# Altium schematic sheet PT-PWR-EPS-002_v1 Project.SchDoc
size A4; DocumentNumber: 12; SheetNumber: 12; SheetTotal: 12
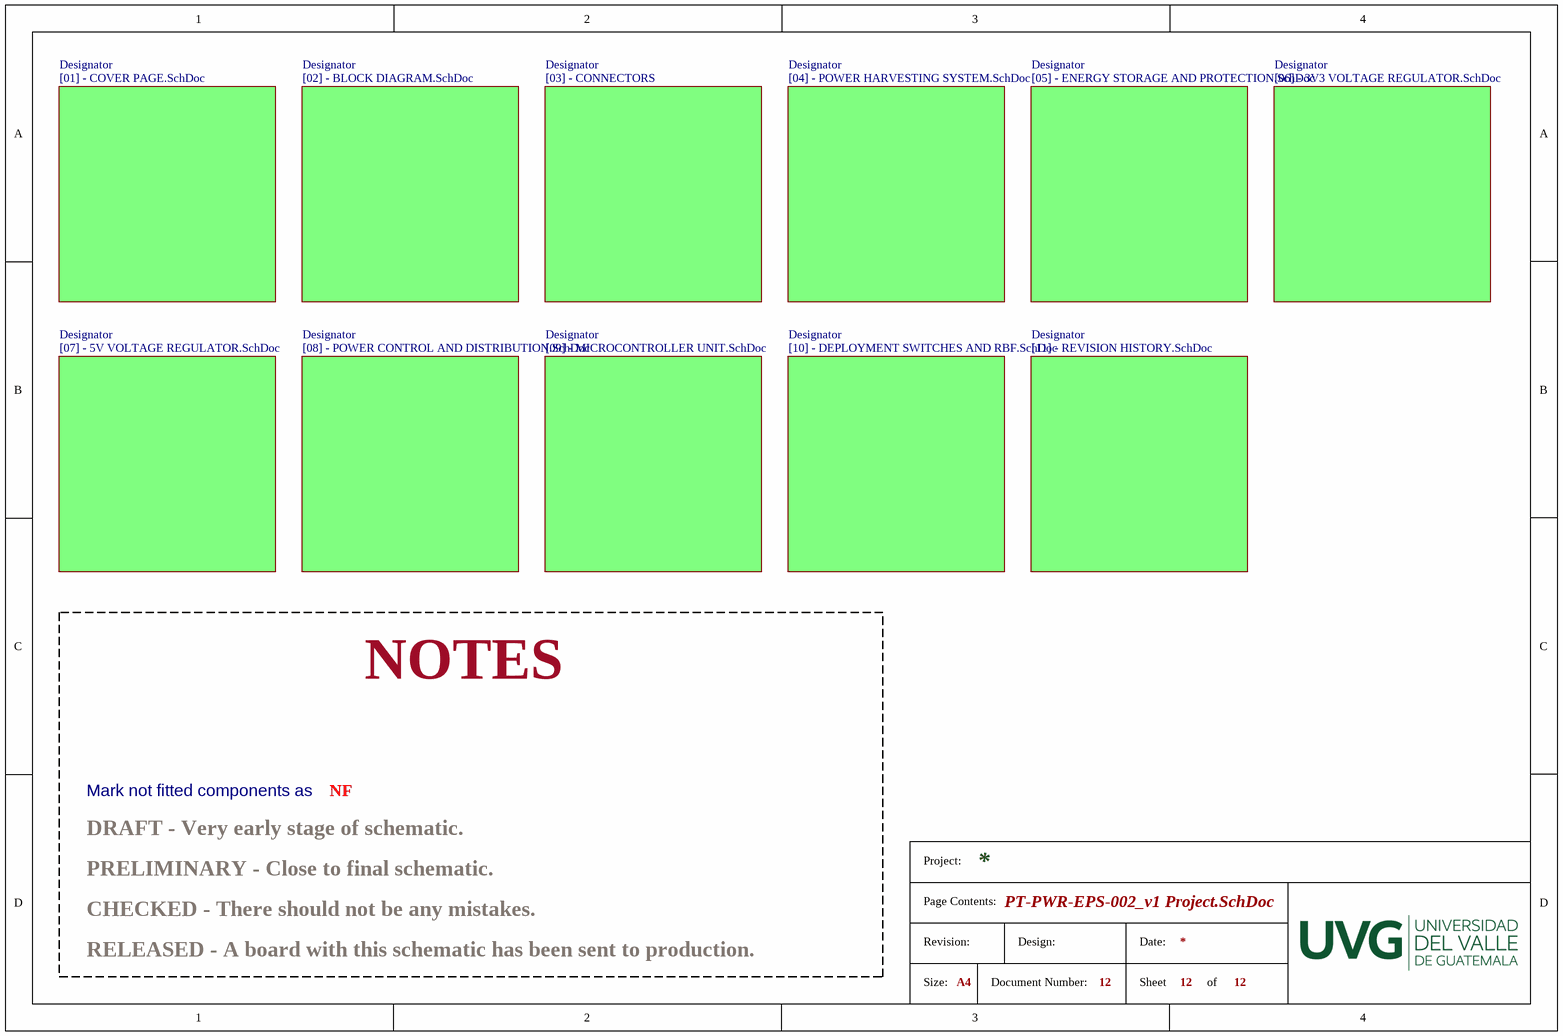
[diagram p0: PT-PWR-EPS-002_v1 Project.SchDoc]

## Sub-sheets
Designator = [01] - COVER PAGE.SchDoc: no entries
Designator = [02] - BLOCK DIAGRAM.SchDoc: no entries
Designator = [06] - 3V3 VOLTAGE REGULATOR.SchDoc: no entries
Designator = [04] - POWER HARVESTING SYSTEM.SchDoc: no entries
Designator = [03] - CONNECTORS: no entries
Designator = [05] - ENERGY STORAGE AND PROTECTION.SchDoc: no entries
Designator = [10] - DEPLOYMENT SWITCHES AND RBF.SchDoc: no entries
Designator = [08] - POWER CONTROL AND DISTRIBUTION.SchDoc: no entries
Designator = [07] - 5V VOLTAGE REGULATOR.SchDoc: no entries
Designator = [11] - REVISION HISTORY.SchDoc: no entries
Designator = [09] - MICROCONTROLLER UNIT.SchDoc: no entries

## Notes on the sheet
- NOTES
- DRAFT - Very early stage of schematic.
- Mark not fitted components as
- NF
- PRELIMINARY - Close to final schematic.
- CHECKED - There should not be any mistakes.
- RELEASED - A board with this schematic has been sent to production.
- Project:
- Page Contents:
- Size:
- Revision:
- A4
- Document Number:
- Design:
- Date:
- Sheet
- of